# EAGLE design main (EAGLE 6.0)
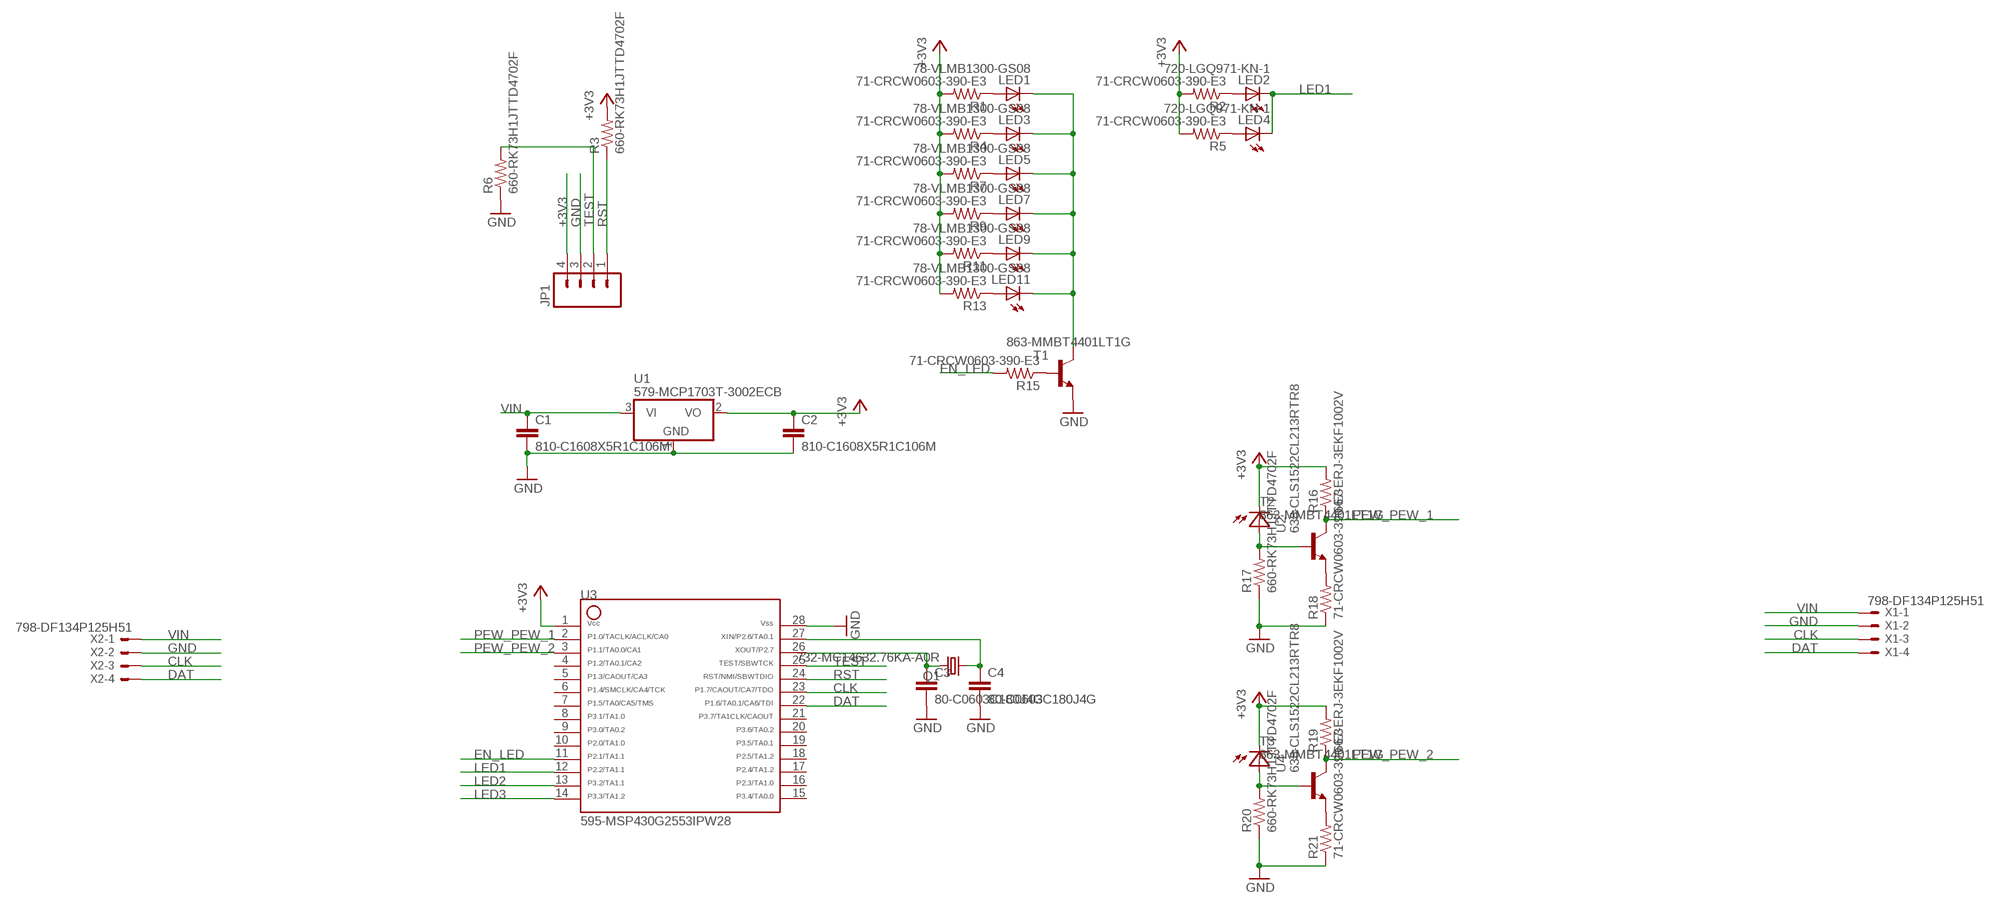
[diagram p0: schematic, sheet 1]

## Parts
C1  810-C1608X5R1C106M  CAP0603-CAP  [0603-CAP]
C2  810-C1608X5R1C106M  CAP0603-CAP  [0603-CAP]
C3  80-C0603C180J4G  CAP0603-CAP  [0603-CAP]
C4  80-C0603C180J4G  CAP0603-CAP  [0603-CAP]
JP1  M04PTH  [1X04]
LED1  78-VLMB1300-GS08  LED0603  [LED-0603]
LED2  720-LGQ971-KN-1  LED0603  [LED-0603]
LED3  78-VLMB1300-GS08  LED0603  [LED-0603]
LED4  720-LGQ971-KN-1  LED0603  [LED-0603]
LED5  78-VLMB1300-GS08  LED0603  [LED-0603]
LED7  78-VLMB1300-GS08  LED0603  [LED-0603]
LED9  78-VLMB1300-GS08  LED0603  [LED-0603]
LED11  78-VLMB1300-GS08  LED0603  [LED-0603]
Q1  732-MC14632.76KA-A0R  CRYSTALEPSONMC146  [CRYSTAL-32KHZ-SMD_EPSON_MC146]
R1  71-CRCW0603-390-E3  R-US_R0603  [R0603]
R2  71-CRCW0603-390-E3  R-US_R0603  [R0603]
R3  660-RK73H1JTTD4702F  R-US_R0603  [R0603]
R4  71-CRCW0603-390-E3  R-US_R0603  [R0603]
R5  71-CRCW0603-390-E3  R-US_R0603  [R0603]
R6  660-RK73H1JTTD4702F  R-US_R0603  [R0603]
R7  71-CRCW0603-390-E3  R-US_R0603  [R0603]
R9  71-CRCW0603-390-E3  R-US_R0603  [R0603]
R11  71-CRCW0603-390-E3  R-US_R0603  [R0603]
R13  71-CRCW0603-390-E3  R-US_R0603  [R0603]
R15  71-CRCW0603-390-E3  R-US_R0603  [R0603]
R16  667-ERJ-3EKF1002V  R-US_R0603  [R0603]
R17  660-RK73H1JTTD4702F  R-US_R0603  [R0603]
R18  71-CRCW0603-390-E3  R-US_R0603  [R0603]
R19  667-ERJ-3EKF1002V  R-US_R0603  [R0603]
R20  660-RK73H1JTTD4702F  R-US_R0603  [R0603]
R21  71-CRCW0603-390-E3  R-US_R0603  [R0603]
T1  863-MMBT4401LT1G  MMBT4401LT1-NPN-SOT23-BEC  [SOT23-BEC]
T2  863-MMBT4401LT1G  MMBT4401LT1-NPN-SOT23-BEC  [SOT23-BEC]
T3  863-MMBT4401LT1G  MMBT4401LT1-NPN-SOT23-BEC  [SOT23-BEC]
U1  579-MCP1703T-3002ECB  MCP1703CB  [SOT23]
U2  638-CLS1522CL213RTR8  CLS15CLS15  [CLS15]
U3  595-MSP430G2553IPW28  MSP430G2553  [PW28]
U4  638-CLS1522CL213RTR8  CLS15CLS15  [CLS15]
X1  798-DF134P125H51  53261-04  [53261-04]
X2  798-DF134P125H51  53261-04  [53261-04]

## Nets
1: R20.2 T3.B U4.1(A) U4.2(A)
121231: R17.2 T2.B U2.1(A) U2.2(A)
+3V3: C2.1 JP1.4 R1.2 R2.2 R3.2 R4.2 R5.2 R7.2 R9.2 R11.2 R13.2 R16.2 R19.2 U1.2(VO) U2.3(C) U2.4(C) U3.1 U4.3(C) U4.4(C)
CLK: U3.23 X1.3 X2.3
DAT: U3.22 X1.4 X2.4
EN_LED: R15.2 U3.11
GND: C1.2 C2.2 C3.2 C4.2 JP1.3 R6.1 R17.1 R18.1 R20.1 R21.1 T1.E U1.1(GND) U3.28 X1.2 X2.2
LED: LED1.C LED3.C LED5.C LED7.C LED9.C LED11.C T1.C
LED1: LED2.C LED4.C U3.12
LED2: U3.13
LED3: U3.14
N$1: LED5.A R7.1
N$2: R18.2 T2.E
N$3: R21.2 T3.E
N$4: LED3.A R4.1
N$5: LED1.A R1.1
N$6: LED11.A R13.1
N$7: LED9.A R11.1
N$9: LED4.A R5.1
N$10: LED2.A R2.1
N$11: LED7.A R9.1
N$12: C4.1 Q1.P$2 U3.27
N$13: C3.1 Q1.P$1 U3.26
N$18: R15.1 T1.B
PEW_PEW_1: R16.1 T2.C U3.2
PEW_PEW_2: R19.1 T3.C U3.3
RST: JP1.1 R3.1 U3.24
TEST: JP1.2 R6.2 U3.25
VIN: C1.1 U1.3(VI) X1.1 X2.1
Unconnected: U3.4 U3.5 U3.6 U3.7 U3.8 U3.9 U3.10 U3.15 U3.16 U3.17 U3.18 U3.19 U3.20 U3.21

## Library data of the parts
C1-C4 = SparkFun-Passives:CAP: Capacitor Standard 0603 ceramic capacitor, and 0.1" leaded capacitor.
JP1 = SparkFun:M04: Header 4 Standard 4-pin 0.1" header. Use with straight break away headers (SKU : PRT-00116), right angle break away headers (PRT-00553), swiss pins (PRT-00743), machine pins (PRT-00117), and female headers (PRT-00115). Molex polarized connector foot print use with SKU : PRT-08231 with associated crimp pins and housings. 1MM SMD Version SKU: PRT-10208
LED1-LED5 LED7 LED9 LED11 = SparkFun-LED:LED: LEDs Standard schematic elements and footprints for 5mm, 3mm, 1206, and 0603 sized LEDs. 5mm - Spark Fun Electronics SKU : COM-00529 (and others)
Q1 = SparkFun:CRYSTAL: Crystals Various standard crystals. Proven footprints. Spark Fun Electronics SKU : COM-00534
R1-R7 R9 R11 R13 R15-R21 = rcl:R-US_: RESISTOR, American symbol
T1-T3 = transistor:*-NPN-: NPN Transistror BF959 corrected 2008.03.06
U1 = linear:MCP1703: 250 mA, 16V, Low Quiescent Current LDO Regulator Source: http://ww1.microchip.com/downloads/en/DeviceDoc/22049b.pdf
U2 U4 = torpedo:CLS15
U3 = torpedo:MSP430G2553
X1 X2 = con-molex:53?-04: CONNECTOR wire to board 1.25 mm (.049 inch) pitch header; OC_FARNELL: 1125374; OC_NEWARK: unknown

## Board
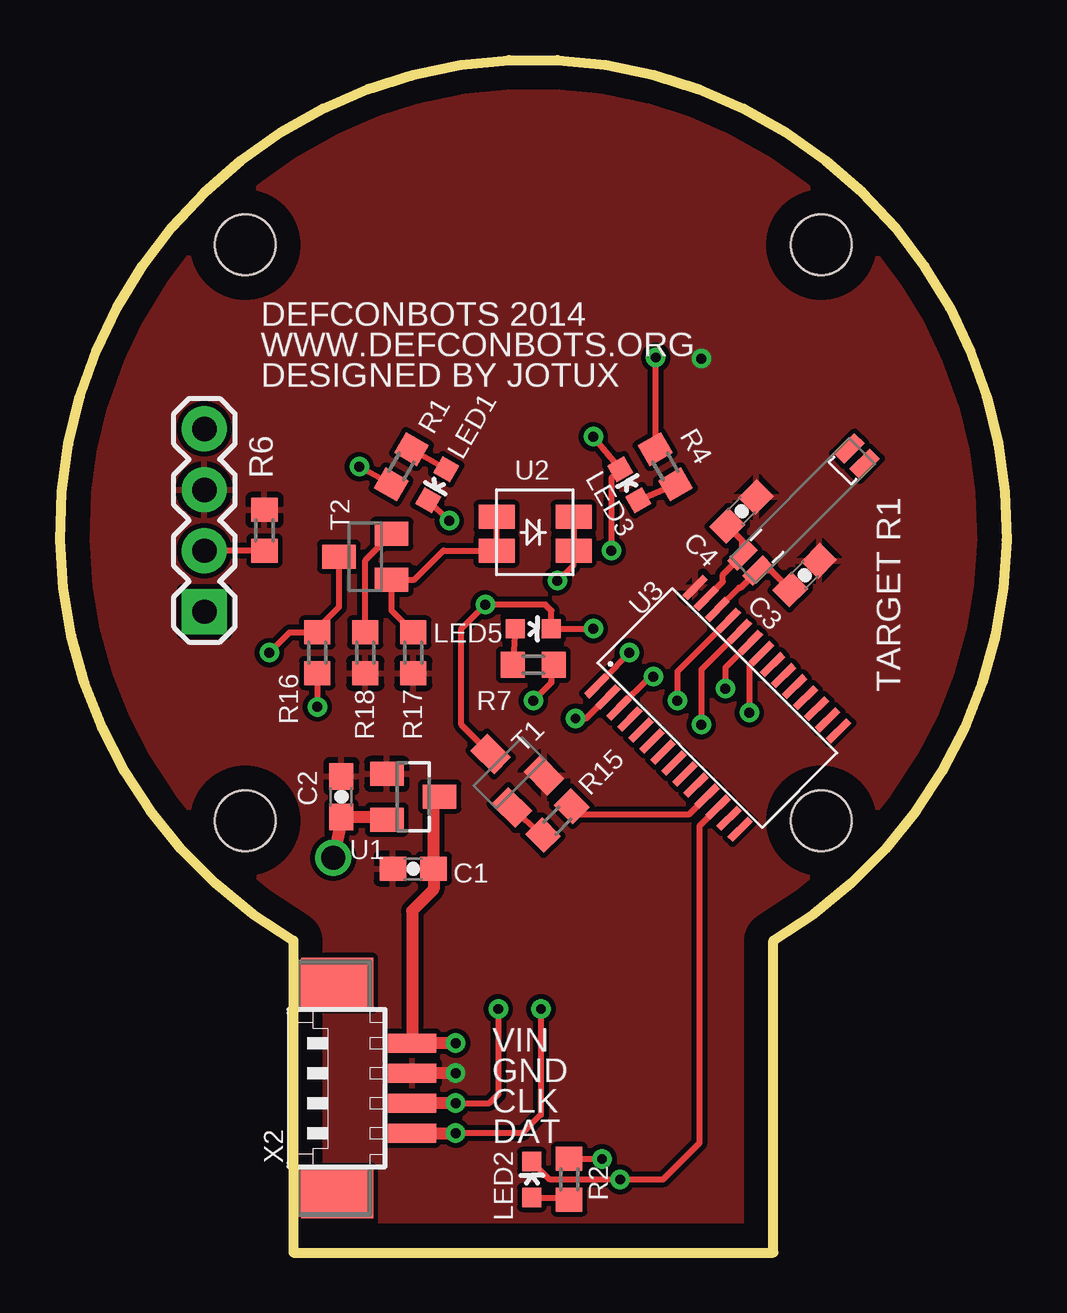
[diagram p1: board, top side]
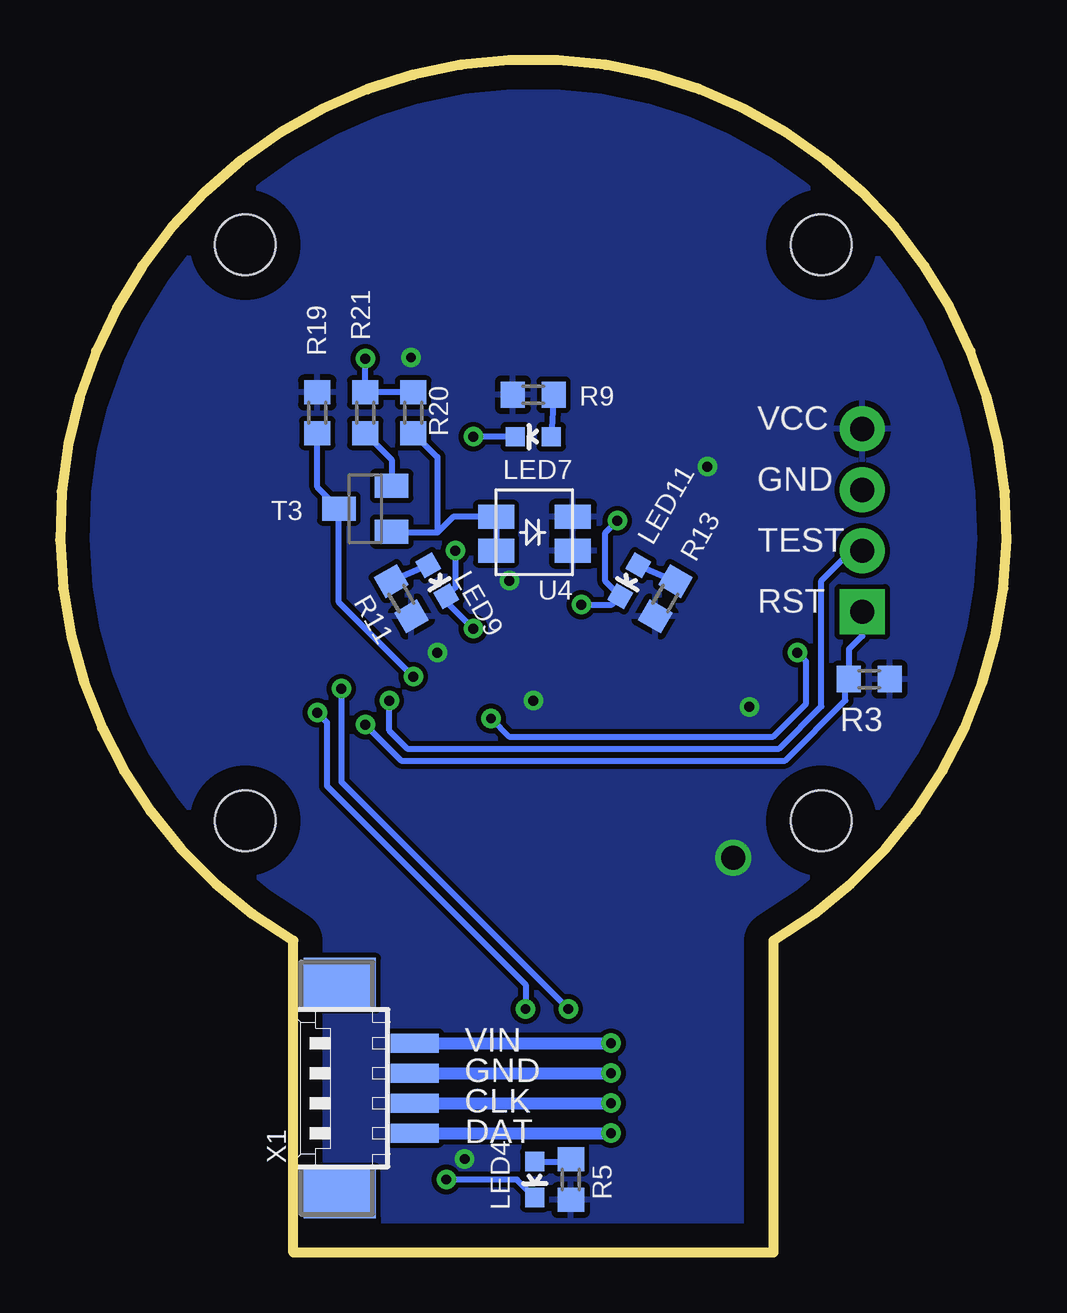
[diagram p2: board, bottom side, seen from below]

Size 39.44 x 49.7 mm. Coordinates in mm from the lower left corner, seen from the top.
Outline: 9.72,13 9.72,0 29.72,0 29.72,13 arc299 9.72,13
Copper layers (1*16): Top 0.035mm / dielectric 1.5mm / Bottom 0.035mm
Design rules: minimum track width 10mil, minimum drill 24mil, track to track 8mil, track to pad 8mil, pad to pad 8mil, via to via 8mil, smd to smd 8mil, copper to edge 40mil, drill to drill 8mil, minimum pad ring 10mil, minimum via ring 8mil, stop-mask expansion 4mil, vias tented up to drill 0mil, thermal gap 10mil
Holes 2.54 mm at 7.72,42 31.72,42 31.72,18 7.72,18

### Footprints (pad centres in the part's own frame; a part is rotated, then mirrored left to right if it is on the bottom)
0603-CAP = smd 1.1 x 1: 1 -0.85,0; 2 0.85,0
1X04 = drill 1.016 pad 1.88 square: 1 0,0 | drill 1.016 pad 1.88: 2 2.54,0; 3 5.08,0; 4 7.62,0
LED-0603 = smd 0.8 x 0.8: A 0,-0.75; C 0,0.75
CRYSTAL-32KHZ-SMD_EPSON_MC146 = smd 1.2 x 0.6: NC1 6.9,1.2; NC2 6.9,0.3; P$1 0.6,0.3; P$2 0.6,1.2
R0603 = smd 1 x 1.1: 1 -0.85,0; 2 0.85,0
SOT23-BEC = smd 1 x 1.4: B -0.95,-1.1; C 0,1.1; E 0.95,-1.1
SOT23 = smd 1 x 1.4: 1 -0.95,-1.1; 2 0.95,-1.1; 3 0,1.1
CLS15 = smd 1.5 x 1: 1 0,0; 2 0,1.4; 3 3.2,1.4; 4 3.2,0
PW28 = smd 0.3 x 1.2: 1 -4.229,-2.908; 2 -3.579,-2.908; 3 -2.929,-2.908; 4 -2.279,-2.908; 5 -1.629,-2.908; 6 -0.979,-2.908; 7 -0.329,-2.908; 8 0.321,-2.908; 9 0.971,-2.908; 10 1.621,-2.908; 11 2.271,-2.908; 12 2.921,-2.908; 13 3.571,-2.908; 14 4.221,-2.908; 15 4.221,2.892; 16 3.571,2.892; 17 2.921,2.892; 18 2.271,2.892; 19 1.621,2.892; 20 0.971,2.892; 21 0.321,2.892; 22 -0.329,2.892; 23 -0.979,2.892; 24 -1.629,2.892; 25 -2.279,2.892; 26 -2.929,2.892; 27 -3.579,2.892; 28 -4.229,2.892
53261-04 = smd 0.8 x 2: 1 1.875,-2.5; 2 0.625,-2.5; 3 -0.625,-2.5; 4 -1.875,-2.5 | smd 2.1 x 3: S1 4.375,0.625; S2 -4.375,0.625

### Placement (x,y rotation side)
C1  14.72,16 180 top
C2  11.72,19 90 top
C3  31.03,28.23 45 top
C4  28.4,30.89 45 top
JP1  6.01,26.71 90 top
LED1  15.72,32 150 top
LED2  19.66,3.05 0 top
LED3  23.72,32 30 top
LED4  19.66,3.05 180 bottom
LED5  19.72,26 270 top
LED7  19.72,34 90 bottom
LED9  23.72,28 210 bottom
LED11  15.72,28 150 bottom
Q1  28.86,27.78 45 top
R1  14.22,32.75 240 top
R2  21.21,3.06 90 top
R3  5.72,23.9 0 bottom
R4  25.22,32.75 120 top
R5  18.16,3.05 270 bottom
R6  8.52,30.1 270 top
R7  19.72,24.5 0 top
R9  19.72,35.75 180 bottom
R11  25.22,27.25 300 bottom
R13  14.22,27.25 240 bottom
R15  20.72,18 45 top
R16  10.72,25 270 top
R17  14.72,25 90 top
R18  12.72,25 90 top
R19  28.72,35 90 bottom
R20  24.72,35 270 bottom
R21  26.72,35 270 bottom
T1  18.72,20 45 top
T2  12.72,29 90 top
T3  26.72,31 90 bottom
U1  14.72,19 270 top
U2  18.2,29.26 0 top
U3  27.41,22.69 315 top
U4  21.27,29.26 0 bottom
X1  27.15,6.86 90 bottom
X2  12.17,6.86 90 top

### Tracks (layer width: path | path; a pad name or v marks a point on that pad's centre or on a via)
1
  Bottom 0.254: 23.72,30 23.06,30.66 U4.2 U4.1 | 23.72,30 25.57,30 T3.B | R20.2 23.72,33.15 23.72,30
121231
  Top 0.254: U2.2 U2.1 15.98,29.26 14.77,28.05 T2.B 13.82,26.75 R17.2
+3V3  (via drill 0.41, 1)
  Top 0.254: R1.2 v12.47,32.75 | v19.72,23 20.47,23.75 R7.2 | U3.1 22.72,23.98 v23.72,25 | R16.2 v10.72,22.75 | U2.3 U2.4 21.4,28.68 v20.72,28 | R4.2 24.82,33.49 v24.82,37.3 | R2.2 v22.58,3.91
  Top 0.504: C2.1 arc-5 v11.39,16.46
  Top 0.508: U1.2 13.62,18.15 C2.1
  pour Bottom: 9.63,-0.25 9.63,9.91 -0.53,9.91 -0.53,50.55 40.11,50.55 40.11,9.91 29.95,9.91 29.95,-0.25
CLK  (via drill 0.41)
  Top 0.254: U3.23 27.72,24.38 v27.72,23.5 | v18.26,10.16 18.26,6.6 17.89,6.23 v16.48,6.23
  Top 0.508: v16.48,6.23 X2.3
  Bottom 0.254: v27.72,23.5 27.72,19.62 v18.26,10.16
  Bottom 0.508: X1.3 v16.48,6.23
DAT  (via drill 0.41)
  Top 0.254: U3.22 28.72,24.46 v28.72,22.5 | v20.04,10.16 20.04,5.74 19.28,4.98 v16.48,4.98
  Top 0.508: X2.4 v16.48,4.98
  Bottom 0.254: v28.72,22.5 28.32,22.1 28.32,19.46 20.04,11.18 v20.04,10.16
  Bottom 0.508: X1.4 v16.48,4.98
EN_LED
  Top 0.254: U3.11 26.19,18.25 21.67,18.25 R15.2
GND  (via drill 0.41)
  Top 0.508: v16.48,7.48 X2.2
  Bottom 0.254: R20.1 R21.1 v26.72,37.25
  Bottom 0.508: X1.2 v16.48,7.48
  pour Top: 9.63,-0.25 9.63,9.91 -0.53,9.91 -0.53,50.55 40.11,50.55 40.11,9.91 29.95,9.91 29.95,-0.25
LED  (via drill 0.41)
  Top 0.254: v22.22,34 LED3.C 22.97,32.28 v22.97,29.25 | v22.22,26 LED5.C 20.47,26.75 20.22,27 v17.72,27 16.72,26 16.72,22 17.72,21 | v16.22,30.5 LED1.C | T1.C 17.72,21 | 17.72,21
  Bottom 0.254: LED7.C v22.22,34 | v22.22,26 23.35,27.12 LED9.C 22.97,27.72 v22.97,29.25 | v16.22,30.5 16.72,30 16.72,27.97 LED11.C 16.45,27 v17.72,27
LED1  (via drill 0.41)
  Top 0.254: U3.12 27.41,18.55 27.41,18.54 26.64,17.78 26.64,4.57 25.12,3.05 v23.34,3.05 20.41,3.05 LED2.C
  Bottom 0.254: LED4.C 20.41,3.05 v23.34,3.05
N$1
  Top 0.254: LED5.A R7.1
N$2
  Top 0.254: R18.2 12.72,28.85 T2.E
N$3
  Bottom 0.254: R21.2 25.62,33.05 T3.E
N$4
  Top 0.254: LED3.A R4.1
N$5
  Top 0.254: LED1.A R1.1
N$6
  Bottom 0.254: LED11.A R13.1
N$7
  Bottom 0.254: LED9.A R11.1
N$9
  Bottom 0.254: LED4.A 18.16,3.8 R5.1
N$10
  Top 0.254: LED2.A 21.21,2.3 R2.1
N$11
  Bottom 0.254: R9.1 LED7.A
N$12
  Top 0.254: C4.1 28.43,29.66 Q1.P$2 27.62,28.24 27.62,27.96 U3.27
N$13
  Top 0.254: C3.1 29.64,28.42 Q1.P$1 28.37,27.71 28.29,27.71 U3.26
N$18
  Top 0.254: R15.1 T1.B
PEW_PEW_1  (via drill 0.41)
  Top 0.254: T2.C 11.62,26.9 10.72,26 R16.1 9.57,25.85 v8.72,25 | U3.2 21.93,22.26 v21.48,22.26
  Bottom 0.254: v21.48,22.26 20.73,21.51 9.73,21.51 8.36,22.88 8.36,24.64 v8.72,25
PEW_PEW_2  (via drill 0.41)
  Top 0.254: U3.3 24.58,24 v24.72,24
  Bottom 0.254: R19.1 28.72,31.9 T3.C 27.82,27.1 v24.72,24
RST  (via drill 0.41)
  Top 0.254: U3.24 26.72,24.3 v26.72,22
  Bottom 0.254: v26.72,22 25.23,20.51 9.23,20.51 6.72,23.02 6.72,24 6.67,24 R3.1 6.57,25.15 6.01,25.71 JP1.1
TEST  (via drill 0.41)
  Top 0.254: U3.25 25.72,24.22 v25.72,23 | R6.2 JP1.2
  Bottom 0.254: JP1.2 6.47,29.25 7.72,28 7.72,22.77 9.48,21.01 24.98,21.01 25.72,21.75 v25.72,23
VIN  (via drill 0.41)
  Top 0.508: U1.3 15.57,18.75 C1.1 15.57,15.15 14.67,14.25 X2.1 v16.48,8.73
  Bottom 0.508: X1.1 v16.48,8.73

### Text on the board
tPlace: DEFCONBOTS 2014 | WWW.DEFCONBOTS.ORG | DESIGNED BY JOTUX | TARGET R1 | VIN | GND | CLK | DAT
bPlace: VCC | GND | TEST | RST | VIN | GND | CLK | DAT